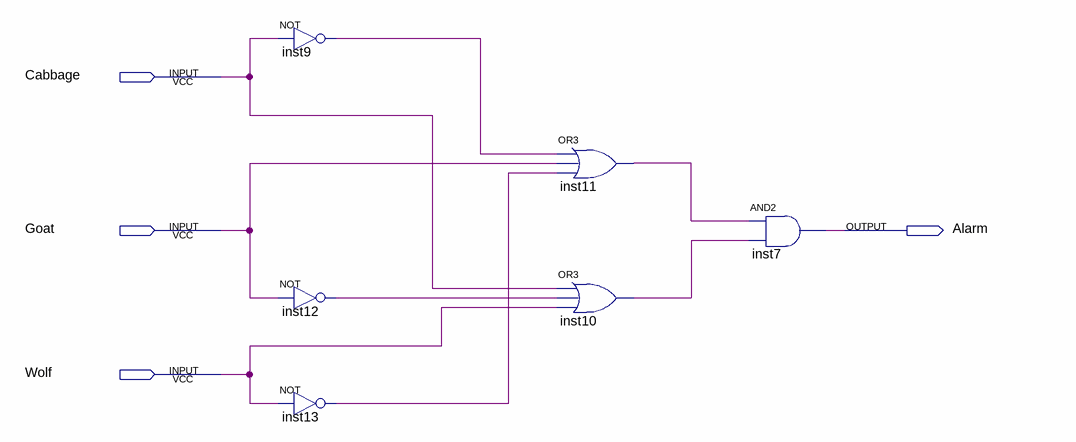
[diagram p0: schematic sheet]
// Quartus schematic lab3step0.bdf as structural Verilog: 6 symbols, 4 pins
module lab3step0 (
  input  Cabbage,
  input  Goat,
  input  Wolf,
  output Alarm
);

  wire inst9_out, inst10_out, inst11_out, inst12_out, inst13_out;

  not inst9 (inst9_out, Cabbage);
  not inst12 (inst12_out, Goat);
  not inst13 (inst13_out, Wolf);
  or inst11 (inst11_out, inst9_out, Goat, inst13_out);
  or inst10 (inst10_out, Cabbage, inst12_out, Wolf);
  and inst7 (Alarm, inst11_out, inst10_out);
endmodule
